# Altium schematic sheet Motor_Driver.SchDoc
size C; DrawnBy: Nurul Hidayat; Engineer: Nurul Hidayat; SheetNumber: 1; SheetTotal: 4
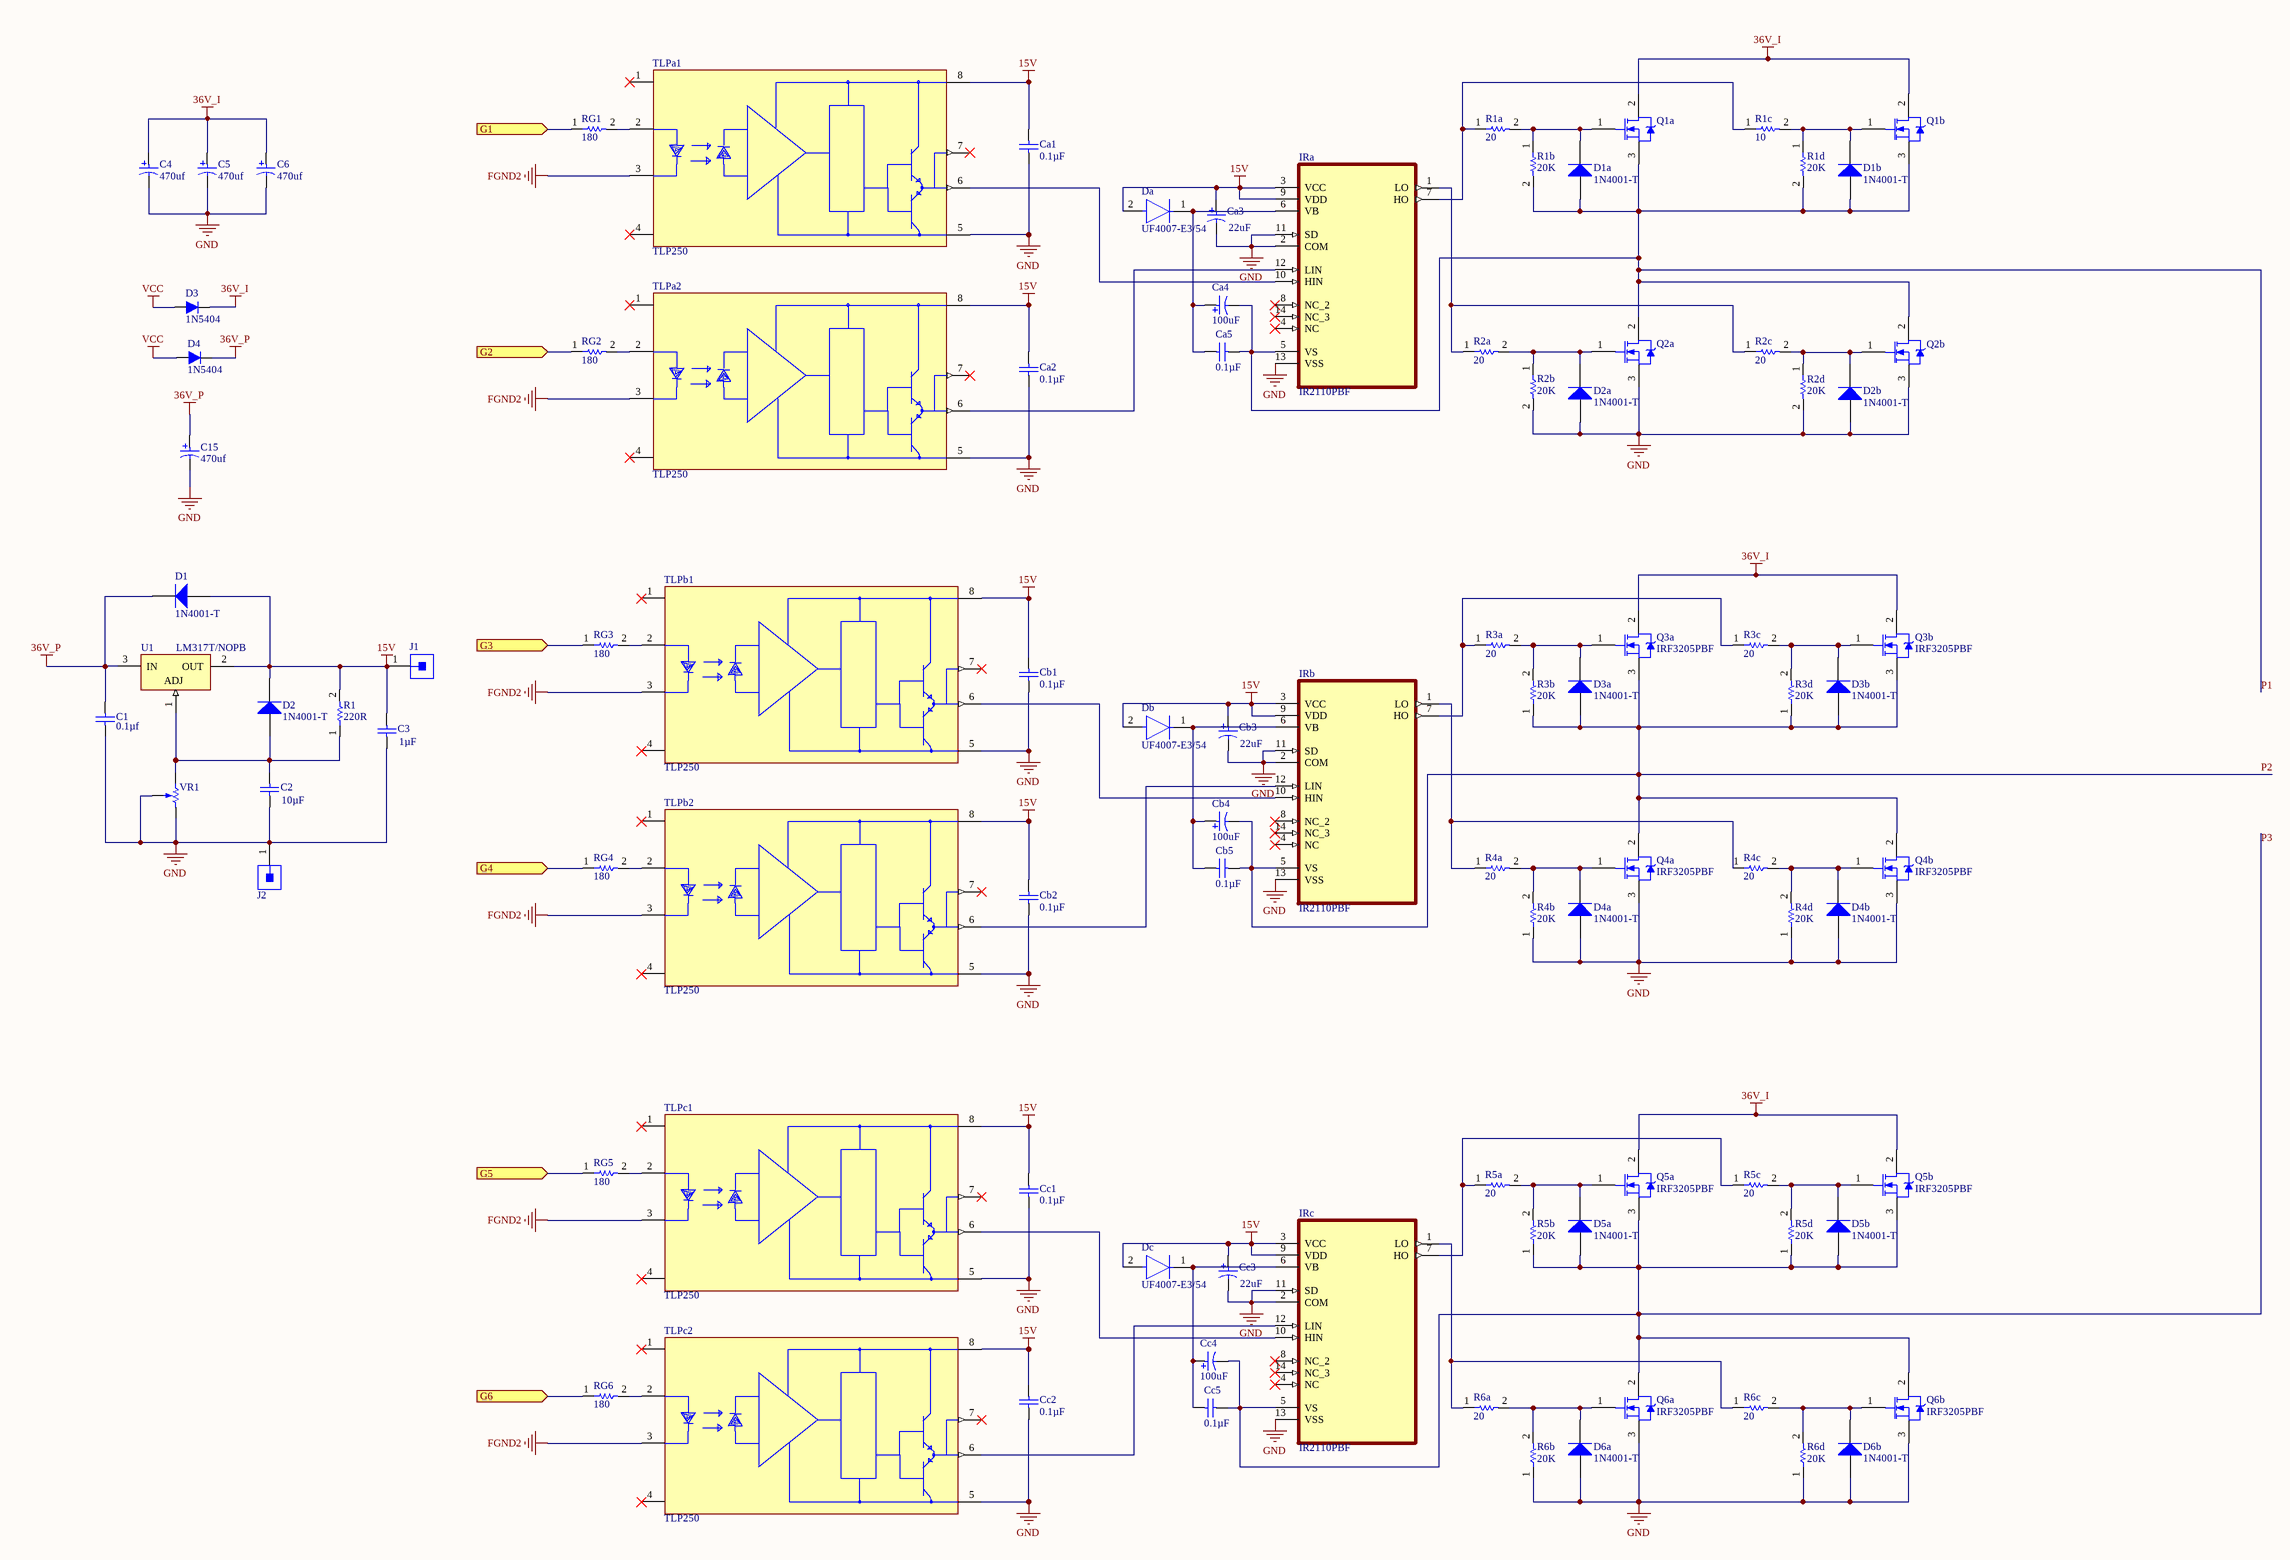
[diagram p0: Motor_Driver.SchDoc]

## Parts
C1  0.1µF  [Cap-0.1uf-50V-Ceramic1]
C2  Capacitance: 10µF  [Cap-0.1uf-50v-ceramic]  (hidden comment: K104K15X7RF5TL2)
C3  Capacitance: 1µF  [Cap-0.1uf-50v-ceramic]  (hidden comment: K104K15X7RF5TL2)
C4  470uf  [Cap-470uf-63v-radial]
C5  470uf  [Cap-470uf-63v-radial]
C6  470uf  [Cap-470uf-63v-radial]
C15  470uf  [Cap-470uf-63v-radial]
Ca1  0.1µF  [Cap-0.1uf-50V-Ceramic1]
Ca2  0.1µF  [Cap-0.1uf-50V-Ceramic1]
Ca3  Capacitance: 22uF  [CAP-22uf-50v-radial]  (hidden comment: ECA1HM220)
Ca4  Capacitance: 100uF  [Cap-100uf-50v-radial]  (hidden comment: ECA1HM101)
Ca5  0.1µF  [Cap-0.1uf-50V-Ceramic1]
Cb1  0.1µF  [Cap-0.1uf-50V-Ceramic1]
Cb2  0.1µF  [Cap-0.1uf-50V-Ceramic1]
Cb3  Capacitance: 22uF  [CAP-22uf-50v-radial]  (hidden comment: ECA1HM220)
Cb4  Capacitance: 100uF  [Cap-100uf-50v-radial]  (hidden comment: ECA1HM101)
Cb5  0.1µF  [Cap-0.1uf-50V-Ceramic1]
Cc1  0.1µF  [Cap-0.1uf-50V-Ceramic1]
Cc2  0.1µF  [Cap-0.1uf-50V-Ceramic1]
Cc3  Capacitance: 22uF  [CAP-22uf-50v-radial]  (hidden comment: ECA1HM220)
Cc4  Capacitance: 100uF  [Cap-100uf-50v-radial]  (hidden comment: ECA1HM101)
Cc5  0.1µF  [Cap-0.1uf-50V-Ceramic1]
D1  1N4001-T  [Diode-1N4001]
D1a  1N4001-T  [Diode-1N4001]
D1b  1N4001-T  [Diode-1N4001]
D2  1N4001-T  [Diode-1N4001]
D2a  1N4001-T  [Diode-1N4001]
D2b  1N4001-T  [Diode-1N4001]
D3  1N5404  [Diode-1N5404]
D3a  1N4001-T  [Diode-1N4001]
D3b  1N4001-T  [Diode-1N4001]
D4  1N5404  [Diode-1N5404]
D4a  1N4001-T  [Diode-1N4001]
D4b  1N4001-T  [Diode-1N4001]
D5a  1N4001-T  [Diode-1N4001]
D5b  1N4001-T  [Diode-1N4001]
D6a  1N4001-T  [Diode-1N4001]
D6b  1N4001-T  [Diode-1N4001]
Da  UF4007-E3/54  [Diode-UF4007]
Db  UF4007-E3/54  [Diode-UF4007]
Dc  UF4007-E3/54  [Diode-UF4007]
IRa  IR2110PBF  [Mosfet-Driver-IR2110PBF]
IRb  IR2110PBF  [Mosfet-Driver-IR2110PBF]
IRc  IR2110PBF  [Mosfet-Driver-IR2110PBF]
J1  61300111121  [PIN-HEADER-1PIN]  (value not drawn)
J2  61300111121  [PIN-HEADER-1PIN]  (value not drawn)
Q1a  IRF3205PBF  [Mosfet-IRF3205]  (value not drawn)
Q1b  IRF3205PBF  [Mosfet-IRF3205]  (value not drawn)
Q2a  IRF3205PBF  [Mosfet-IRF3205]  (value not drawn)
Q2b  IRF3205PBF  [Mosfet-IRF3205]  (value not drawn)
Q3a  IRF3205PBF  [Mosfet-IRF3205]
Q3b  IRF3205PBF  [Mosfet-IRF3205]
Q4a  IRF3205PBF  [Mosfet-IRF3205]
Q4b  IRF3205PBF  [Mosfet-IRF3205]
Q5a  IRF3205PBF  [Mosfet-IRF3205]
Q5b  IRF3205PBF  [Mosfet-IRF3205]
Q6a  IRF3205PBF  [Mosfet-IRF3205]
Q6b  IRF3205PBF  [Mosfet-IRF3205]
R1  220R  [Resistor-1-Watt]
R1a  20  [Resistor-1-Watt]
R1b  20K  [Resistor-1-Watt]
R1c  10  [Resistor-1-Watt]
R1d  20K  [Resistor-1-Watt]
R2a  20  [Resistor-1-Watt]
R2b  20K  [Resistor-1-Watt]
R2c  20  [Resistor-1-Watt]
R2d  20K  [Resistor-1-Watt]
R3a  20  [Resistor-1-Watt]
R3b  20K  [Resistor-1-Watt]
R3c  20  [Resistor-1-Watt]
R3d  20K  [Resistor-1-Watt]
R4a  20  [Resistor-1-Watt]
R4b  20K  [Resistor-1-Watt]
R4c  20  [Resistor-1-Watt]
R4d  20K  [Resistor-1-Watt]
R5a  20  [Resistor-1-Watt]
R5b  20K  [Resistor-1-Watt]
R5c  20  [Resistor-1-Watt]
R5d  20K  [Resistor-1-Watt]
R6a  20  [Resistor-1-Watt]
R6b  20K  [Resistor-1-Watt]
R6c  20  [Resistor-1-Watt]
R6d  20K  [Resistor-1-Watt]
RG1  180  [Resistor-1-Watt]
RG2  180  [Resistor-1-Watt]
RG3  180  [Resistor-1-Watt]
RG4  180  [Resistor-1-Watt]
RG5  180  [Resistor-1-Watt]
RG6  180  [Resistor-1-Watt]
TLPa1  TLP250  [Opto-Coupler-TLP250]
TLPa2  TLP250  [Opto-Coupler-TLP250]
TLPb1  TLP250  [Opto-Coupler-TLP250]
TLPb2  TLP250  [Opto-Coupler-TLP250]
TLPc1  TLP250  [Opto-Coupler-TLP250]
TLPc2  TLP250  [Opto-Coupler-TLP250]
U1  LM317T/NOPB  [Voltage-Regulator-LM317]
VR1  3296W-1-103LF  [Resistor-Trimmer]  (value not drawn)

## Ports
G1 (in), G2 (in), G3 (in), G4 (in), G5 (in), G6 (in)

## Nets
15V: C3.2 Ca1.2 Ca2.2 Ca3.1 Cb1.2 Cb2.2 Cb3.1 Cc1.2 Cc2.2 Cc3.1 D1.1(A) D2.2(K) Da.2(A) Db.2(A) Dc.2(A) IRa.3(VCC) IRa.9(VDD) IRb.3(VCC) IRb.9(VDD) IRc.3(VCC) IRc.9(VDD) J1.1 R1.2 TLPa1.8(VCC) TLPa2.8(VCC) TLPb1.8(VCC) TLPb2.8(VCC) TLPc1.8(VCC) TLPc2.8(VCC) U1.2(OUT)
36V_I: C4.1 C5.1 C6.1 D3.2(K) Q1a.2(D) Q1b.2(D) Q3a.2(D) Q3b.2(D) Q5a.2(D) Q5b.2(D)
36V_P: C1.2 C15.1 D1.2(K) D4.2(K) U1.3(IN)
FGND2: TLPa1.3(C) TLPa2.3(C) TLPb1.3(C) TLPb2.3(C) TLPc1.3(C) TLPc2.3(C)
GND: C1.1 C2.1 C3.1 C4.2 C5.2 C6.2 C15.2 Ca1.1 Ca2.1 Ca3.2 Cb1.1 Cb2.1 Cb3.2 Cc1.1 Cc2.1 Cc3.2 D2a.1(A) D2b.1(A) D4a.1(A) D4b.1(A) D6a.1(A) D6b.1(A) IRa.2(COM) IRa.11(SD) IRa.13(VSS) IRb.2(COM) IRb.11(SD) IRb.13(VSS) IRc.2(COM) IRc.11(SD) IRc.13(VSS) J2.1 Q2a.3(S) Q2b.3(S) Q4a.3(S) Q4b.3(S) Q6a.3(S) Q6b.3(S) R2b.2 R2d.2 R4b.1 R4d.1 R6b.1 R6d.1 TLPa1.5(GND) TLPa2.5(GND) TLPb1.5(GND) TLPb2.5(GND) TLPc1.5(GND) TLPc2.5(GND) VR1.2(S) VR1.3(CW)
VCC: D3.1(A) D4.1(A)
G1: RG1.1 ; port G1
G2: RG2.1 ; port G2
G3: RG3.1 ; port G3
G4: RG4.1 ; port G4
G5: RG5.1 ; port G5
G6: RG6.1 ; port G6
P1: Ca4.2 Ca5.1 D1a.1(A) D1b.1(A) IRa.5(VS) Q1a.3(S) Q1b.3(S) Q2a.2(D) Q2b.2(D) R1b.2 R1d.2
P2: Cb4.2 Cb5.1 D3a.1(A) D3b.1(A) IRb.5(VS) Q3a.3(S) Q3b.3(S) Q4a.2(D) Q4b.2(D) R3b.1 R3d.1
P3: Cc4.2 Cc5.1 D5a.1(A) D5b.1(A) IRc.5(VS) Q5a.3(S) Q5b.3(S) Q6a.2(D) Q6b.2(D) R5b.1 R5d.1
NetC2_2: C2.2 D2.1(A) R1.1 U1.1(ADJ) VR1.1(CCW)
NetCa4_1: Ca4.1 Ca5.2 Da.1(C) IRa.6(VB)
NetCb4_1: Cb4.1 Cb5.2 Db.1(C) IRb.6(VB)
NetCc4_1: Cc4.1 Cc5.2 Dc.1(C) IRc.6(VB)
NetD1a_2: D1a.2(K) Q1a.1(G) R1a.2 R1b.1
NetD1b_2: D1b.2(K) Q1b.1(G) R1c.2 R1d.1
NetD2a_2: D2a.2(K) Q2a.1(G) R2a.2 R2b.1
NetD2b_2: D2b.2(K) Q2b.1(G) R2c.2 R2d.1
NetD3a_2: D3a.2(K) Q3a.1(G) R3a.2 R3b.2
NetD3b_2: D3b.2(K) Q3b.1(G) R3c.2 R3d.2
NetD4a_2: D4a.2(K) Q4a.1(G) R4a.2 R4b.2
NetD4b_2: D4b.2(K) Q4b.1(G) R4c.2 R4d.2
NetD5a_2: D5a.2(K) Q5a.1(G) R5a.2 R5b.2
NetD5b_2: D5b.2(K) Q5b.1(G) R5c.2 R5d.2
NetD6a_2: D6a.2(K) Q6a.1(G) R6a.2 R6b.2
NetD6b_2: D6b.2(K) Q6b.1(G) R6c.2 R6d.2
NetIRa_1: IRa.1(LO) R2a.1 R2c.1
NetIRa_7: IRa.7(HO) R1a.1 R1c.1
NetIRa_10: IRa.10(HIN) TLPa1.6(VO(Output))
NetIRa_12: IRa.12(LIN) TLPa2.6(VO(Output))
NetIRb_1: IRb.1(LO) R4a.1 R4c.1
NetIRb_7: IRb.7(HO) R3a.1 R3c.1
NetIRb_10: IRb.10(HIN) TLPb1.6(VO(Output))
NetIRb_12: IRb.12(LIN) TLPb2.6(VO(Output))
NetIRc_1: IRc.1(LO) R6a.1 R6c.1
NetIRc_7: IRc.7(HO) R5a.1 R5c.1
NetIRc_10: IRc.10(HIN) TLPc1.6(VO(Output))
NetIRc_12: IRc.12(LIN) TLPc2.6(VO(Output))
NetRG1_2: RG1.2 TLPa1.2(A)
NetRG2_2: RG2.2 TLPa2.2(A)
NetRG3_2: RG3.2 TLPb1.2(A)
NetRG4_2: RG4.2 TLPb2.2(A)
NetRG5_2: RG5.2 TLPc1.2(A)
NetRG6_2: RG6.2 TLPc2.2(A)

Not connected (* = marked no-connect by the designer): IRa 4(NC)* 8(NC_2)* 14(NC_3)*; IRb 4(NC)* 8(NC_2)* 14(NC_3)*; IRc 4(NC)* 8(NC_2)* 14(NC_3)*; TLPa1 1(NC)* 4(NC)* 7(VO)*; TLPa2 1(NC)* 4(NC)* 7(VO)*; TLPb1 1(NC)* 4(NC)* 7(VO)*; TLPb2 1(NC)* 4(NC)* 7(VO)*; TLPc1 1(NC)* 4(NC)* 7(VO)*; TLPc2 1(NC)* 4(NC)* 7(VO)*

## Library data of the parts
C1 Ca1 Ca2 Ca5 Cb1 Cb2 Cb5 Cc1 Cc2 Cc5 = Cap-0.1uf-50V-Ceramic_1: Lead Capacitor X7R_EIA_ with Capacitance: 0.10F and Rated Voltage: 50Vdc; MP: RDER71H104K0K1H03B; MF: Murata; Package: NONSTANDARD; Price: None; Availability: Unavailable; SnapEDA_Link: https://www.snapeda.com/parts/RDER71H104K0K1H03B/Murata/view-part/4545566/?ref=snap
  C1: Value: 0.1µf
  Ca1 Ca2 Ca5 Cb1 Cb2 Cb5 Cc1 Cc2 Cc5: Value: *
C2 C3 = Cap-0.1uf-50v-ceramic: Ceramic Capacitor, 100 nF, +/- 10%, 50 V, -55 to 125 degC, 2-Pin THD, RoHS, Tape and Reel; Manufacturer: Vishay; Other Names: BC1084CT; Catalog Drawings: Mono-KapSide2-15_5.58Mono-KapSide1_15; Temperature Coefficient: X7R; Voltage - Rated: 50V; Online Catalog: Mono-Kap™Series; Size / Dimension: 0.157"Lx0.098"W(4.00mmx2.50mm); Operating Temperature: -55°C~125°C; Family: CeramicCapacitors; Manufacturer URL: http://www.vishay.com/; Standard Package: 1; Thickness (Max): -; Ratings: -; Datasheet Version: 08/2013; Package Description: 2-Pin Through Hole Device, Body 4 x 2.6 mm; Mounting Type: ThroughHole; Features: -; Lead Spacing: 0.098"(2.50mm); Tolerance: ±10%; Category: Capacitors; Mounting Technology: ThroughHole; Lead Style: Straight; Datasheet URL: http://www.vishay.com/docs/45171/kseries.pdf; Applications: GeneralPurpose; Package / Case: Radial; Height - Seated (Max): 0.220"(5.58mm); Package Reference: K104K15X7RF5TL2; Series: Mono-Kap™K; Packaging: CutTape(CT)
C4-C6 C15 = Cap-470uf-63v-radial: Aluminum Electrolytic Capacitor, 470 uF, +/- 20%, 50 V, -40 to 85 degC, 2-Pin THD, RoHS, Bulk; Voltage Rating: 10 V; Case\Package: 1210; Tolerance: 10%; Capacitance: 47 uF; Type (Capacitors): X7R; ComponentLink1URL: http://www.panasonic.com/; PackageDescription: 2-Pin Radial Lead, Dia 10 mm, Body Length 20 mm; RoHSCompliant: true; Mount: Surface Mount; Radiation Hardening: No; PackageReference: CAPPR65-500-2000X1000X2200; ComponentLink1Description: Manufacturer URL; DatasheetVersion: Mar-16; Case Code (Imperial): 1210; Max Operating Temperature: 125 degC; Height: 2.5 mm; Voltage Rating (DC): 10 V; REACH SVHC: No SVHC; ComponentLink2URL: http://industrial.panasonic.com/cdbs/www-data/pdf/RDF0000/ABA0000C1047.pdf; Length: 3.2 mm; Min Operating Temperature: -55 degC; Case Code (Metric): 3225; Width: 2.5 mm; Pins: 2; Packaging: Tape and Reel; Package Quantity: 1000; ComponentLink2Description: Datasheet
Ca3 Cb3 Cc3 = Cap-22uf-50v-radial: Aluminum Electrolytic Capacitor, 22 uF, +/- 20%, 50 V, -40 to 85 degC, 2-Pin THD, RoHS, Bulk; Manufacturer: Panasonic; Ripple Current: 100mA; Life (Hours): 2000Hour; Voltage: 50V; Dissipation Factor: 0.12%; Leakage Current: 3uA; Lead/Base Style: Straight; Lead Diameter: 0.5mm; Max Operating Temperature: 85degC; Height: 11mm; Package Reference: CAPPR55-200-1100X500X1200; Radiation Hardening: No; RoHSCompliant: true; Termination: Radial; Case/Package: Radial; REACH SVHC: NoSVHC; Height - Seated (Max): 0.472inch; Min Operating Temperature: -40degC; Packaging: Bulk; Manufacturer URL: http://www.panasonic.com/; Length: 11mm; Tolerance: 20%; Voltage Rating: 50V; Voltage Rating (DC): 50V; Datasheet URL: https://industrial.panasonic.com/cdbs/www-data/pdf/RDF0000/ABA0000C1218.pdf; Lead Pitch: 2mm; Ripple Current (AC): 100mA; Package Description: 2-Pin Radial Lead, Dia 5 mm, Height 12 mm; Diameter: 5mm; Datasheet Version: Rev. 05, 10/2016; Package Quantity: 200; Mount: ThroughHole
Ca4 Cb4 Cc4 = Cap-100uf-50v-radial: Aluminum Electrolytic Capacitor, 100 uF, +/- 20%, 50 V, -40 to 85 degC, 2-Pin THD, RoHS, Bulk; Manufacturer: Panasonic; Lead Diameter: 0.6mm; Dielectric Material: Aluminium; Voltage Rating (DC): 50V; Ripple Current (AC): 250mA; Polarity: Polar; Leakage Current: 3uA; Life (Hours): 2000Hour; Lead/Base Style: Straight; Dissipation Factor: 0.12%; Radiation Hardening: No; Height: 11.5mm; Package Quantity: 200; Package Reference: CAPPR65-350-1150X800X1250; Min Operating Temperature: -40degC; Mount: ThroughHole; Package Description: 2-Pin Radial Lead, Dia 8 mm, Height 12.5 mm; Case/Package: Radial; Diameter: 8mm; Voltage Rating: 50V; Length: 11.5mm; REACH SVHC: NoSVHC; Height - Seated (Max): 0.492inch; Datasheet URL: https://industrial.panasonic.com/cdbs/www-data/pdf/RDF0000/ABA0000C1218.pdf; RoHSCompliant: true; Ripple Current: 250mA; Lead Free: LeadFree; Voltage: 50V; Manufacturer URL: http://www.panasonic.com/; Number of Pins: 2; Datasheet Version: Rev. 05, 10/2016; Packaging: Bulk; Termination: Radial; Max Operating Temperature: 85degC; Tolerance: 20%; Lead Pitch: 3.5mm
D1 D2 = Diode-1N4001: 1.0 A Rectifier, 15 pF, 50 V, -65 to 150 degC, 2-Pin DO-41 Plastic, RoHS, Tape and Reel; Manufacturer: Diodes Inc; Max. Average Rectified Current IO (A): 1; Max. IFSM (A): 30; CT (pF): 15; Max. IR (uA): 5; VRRM (V): 50; DatasheetVersion: Rev. 8-2; ComponentLink2Description: Datasheet; PartNumber: 1N4001-T; ComponentLink2URL: http://diodes.com/datasheets/ds28002.pdf; PackageDescription: 2-Pin Axial Lead, Body 4.635 x 2.36 mm, Lead Spread 25.4 mm; ComponentLink1Description: Manufacturer URL; RoHS: TRUE; Mounting Technology: Through Hole; Packing: Tape and Reel; Operating Temperature Range (degC): -65 to 150; VF (V): 1; ComponentLink1URL: http://diodes.com/; PackageReference: DO-41-P-2
D1a D1b D2a D2b D3a D3b D4a D4b D5a D5b D6a D6b = Diode-1N4001: 1.0 A Rectifier, 15 pF, 50 V, -65 to 150 degC, 2-Pin DO-41 Plastic, RoHS, Tape and Reel; Manufacturer: Diodes Inc; VF (V): 1; CT (pF): 15; Max. IR (uA): 5; VRRM (V): 50; Max. IFSM (A): 30; RoHS: TRUE; Mounting Technology: Through Hole; PartNumber: 1N4001-T; ComponentLink2Description: Datasheet; DatasheetVersion: Rev. 8-2; Operating Temperature Range (degC): -65 to 150; Packing: Tape and Reel; PackageReference: DO-41-P-2; ComponentLink1URL: http://diodes.com/; PackageDescription: 2-Pin Axial Lead, Body 4.635 x 2.36 mm, Lead Spread 25.4 mm; ComponentLink2URL: http://diodes.com/datasheets/ds28002.pdf; Max. Average Rectified Current IO (A): 1; ComponentLink1Description: Manufacturer URL
D3 D4 = Diode-1N5404: Standard Recovery Rectifier, 2-Pin Axial_Lead, Pb-Free, Bulk Box; Manufacturer: On Semiconductor; IFSM Max (A): 200; VRRM Max (V): 400; IO(rec) Max (A): 3; ComponentLink3Description: Package Specification; PackageDescription: 2-Pin, Axial Lead, Diameter 5.05 mm; Type: Standard Recovery; PackageVersion: Rev. G, 06/2000; ComponentLink1Description: Manufacturer URL; ComponentLink2Description: Datasheet; Packing: Bulk Box; PackageReference: AXIAL_LEAD-2-267-05; Mounting Technology: Through Hole; DatasheetVersion: Rev. 10; RoHS: TRUE; ComponentLink3URL: http://www.onsemi.com/pub_link/Collateral/267-05.PDF; PartNumber: 1N5404; ComponentLink2URL: http://www.onsemi.com/pub_link/Collateral/1N5400-D.PDF; ComponentLink1URL: http://www.onsemi.com/
Da Db Dc = Diode-UF4007: DIODE GEN PURP 1KV 1A DO204AL; Manufacturer: Vishay; Max Junction Temp: +150°C; Max Repetitive Reverse Voltage: 1000V; Max Surge Forward Current: 30A; Capacitance: 17pF; Peak Reverse Current: 10uA; Value: 17pF; Package: UF4007; Height: 2.7mm; RoHS: TRUE; Device Class L3: Rectifier Diodes; Temperature Range Low: -55°C; Ipc Land Pattern Name: DIOPA1088W105L520D270; Temperature: -55°C to +150°C; Category: Diode; Device Class L2: Diodes; Device Class L1: Discrete Semiconductors; Digikey Description: DIODE GEN PURP 1KV 1A DO204AL; Octopart: https://octopart.com/uf4007-e3%2F54-vishay-42333894; Mouser Description: Rectifiers Vr/1000V Io/1A; ComponentLink2URL: http://www.vishay.com/docs/88755/uf4001.pdf; Lead Free: Yes; Temperature Range High: +150°C; Automotive: No; Manufacturer Part Number: UF4007-E3/54; ComponentLink2Description: Datasheet; Forward Current: 1A
IRa IRb IRc = IR2110PBF: Floating channel designed for bootstrap operation | Fully operational to +500 V | Fully operational to +600 V verstion available _IR2113 | dV/dt immune | Gate drive supply range from 10 to 20 V | Undervoltage lockout for both channels | 3.3 V logic compatible | Separate logic supply range from 3.3 V to 20 V | Logic and power ground + /- 5 V offset | CMOS Schmitt-triggered inputs with pull-down | Cycle by cycle edge-triggered shutdown logic | Matched propagation delay for both channels | Outputs in phase with inputs; MF: Infineon; MP: IR2110PBF; Price: None; Package: DIP-14 Infineon; Value: *; Availability: Unavailable; SnapEDA_Link: https://www.snapeda.com/parts/IR2110PBF/Infineon%20Technologies/view-part/547122/?ref=snap
J1 J2 = Pin-Header-1Pin: THT Vertical Pin Header WR-PHD, Pitch 2.54 mm, Single Row, 1 pins; Manufacturer: Wurth Elektronik; Gender: Male; Working Voltage: 250VAC; Withstanding Voltage: 500VAC; Pin Number: 1; Contact Resistance: 20mOhm; Rated Current: 3A; Pitch: 2.54mm; Mounting Technology: THT; Datasheet URL: https://katalog.we-online.de/em/datasheet/6130xx11121.pdf; Manufacturer URL: http://www.we-online.de; Operating Temperature: -40to105degC; Publisher: WurthElektronik; Part Number: 61300111121; Row Number: Single; Package Reference: 61300111121; Orientation: Vertical; Packaging: Bag
Q1a Q1b Q2a Q2b Q3a Q3b Q4a Q4b Q5a Q5b Q6a Q6b = Mosfet-IRF3205: HEXFET(R) Power N-Channel MOSFET, 55 V, 110 A, -55 to 117 degC, 3-Pin TO-220AB, RoHS, Rail/Tube; Manufacturer: International Rectifier; Typical Gate Charge @ Vgs: 146nC@10V; Maximum Gate Source Voltage: ±20V; Maximum Continuous Drain Current: 110A; Typical Input Capacitance @ Vds: 3247pF@25V; Channel Type: N; Minimum Gate Threshold Voltage: 2V; Number of Elements per Chip: 1; Transistor Configuration: Single; Transistor Material: Si; Maximum Drain Source Voltage: 55V; Maximum Gate Threshold Voltage: 4V; Typical Turn-Off Delay Time: 50ns; Typical Turn-On Delay Time: 14ns; Channel Mode: Enhancement; Maximum Drain Source Resistance: 0.008Ω; Maximum Power Dissipation: 200W; Package Version: Feb-04; Package Type: TO-220AB; Width: 4.69mm; Dimensions: 10.54x4.69x8.77mm; Category: PowerMOSFET; Package URL: http://www.infineon.com/dgdl/bts110.pdf?folderId=db3a304412b407950112b43583c16310&fileId=db3a304412b407950112b43584326311&sId=db3a30443e3c704d013e4eb6657a2604; Package Description: 3-Pin Plastic (Green) Transistor Single Outline Package, 9.9 x 9.2 mm Body, 2.54 mm Pitch; Package Reference: PG-TO-220AB; Length: 10.54mm; Height: 8.77mm; Datasheet Version: Jul-10; Minimum Operating Temperature: -55degC; Manufacturer URL: http://internationalrectifier.com/; Datasheet URL: http://datasheet.octopart.com/IRF3205PBF-International-Rectifier-datasheet-10898897.pdf; Maximum Operating Temperature: +175degC; Pin Count: 3; Mounting Type: ThroughHole
R1 R1a R1b R1c R1d R2a R2b R2c R2d R3a R3b R3c R3d R4a R4b R4c R4d R5a R5b R5c R5d R6a R6b R6c R6d RG1-RG6 = Resistor-1-Watt: Resistor; Manufacturer_Name: Ohmite; Manufacturer_Part_Number: OK1025E-R52; Datasheet Link: https://www.alliedelec.com/m/d/7f961050c862e52d900c42b673f6b00a.pdf; Mouser Part Number: 588-OK1025E-R52; Mouser Price/Stock: https://www.mouser.co.uk/ProductDetail/Ohmite/OK1025E-R52?qs=AkUtuiJmyfnfEYTpIxxGIg%3D%3D
TLPa1 TLPa2 TLPb1 TLPb2 TLPc1 TLPc2 = TLP250: Optocoupler Drive Push-Pull 1-CH 30V 600V 8-Pin PDIP; Manufacturer: TOSHIBA; Standoff Height: 0.55mm; Turn Off Delay Time: 0.15us; Max Junction Temp: +125°C; Power Dissipation: 800mW; Forward Current: 10mA; Reverse Voltage: 5V; Forward Voltage: 1.6V; Isolation Voltage: 2500Vrms; Min Supply Voltage: 10V; ComponentLink2Description: Datasheet; Octopart: https://octopart.com/tlp-250-toshiba-99104964; Automotive: No; Temperature Range High: +85°C; Lead Free: Yes; Package: 11-10C4; Category: Trans; Temperature Range Low: -20°C; Ipc Land Pattern Name: DIP762W50P254L966H445Q8; ComponentLink2URL: https://toshiba.semicon-storage.com/info/docget.jsp?did=16821&prodName=TLP250; Device Class L3: unset; Turn On Delay Time: 0.15us; Device Class L2: Optocouplers; Manufacturer Part Number: TLP250; Max Supply Voltage: 30V; Height: 4.85mm; Device Class L1: Optoelectronics; Temperature: -20°C to +85°C; RoHS: TRUE
U1 = Voltage-Regulator-LM317: 3-Terminal Adjustable Regulator, 3-pin TO-220, Pb-Free; Manufacturer: Texas Instruments; PackageTopMarking: NSUZXYTTE#*LM317T P+; PowerWise: N; CompType: LDO IC; ComponentLink1URL: http://www.ti.com/general/docs/lit/getliterature.tsp?genericPartNumber=LM317-N&fileType=pdf; PackageDescription: TO-220, Molded, 3 Lead, Straight; PackageReference: NDE0003A; ComponentLink1Description: Datasheet URL; RoHS: Y; PinCount: 3
VR1 = Resistor-Trimmer: Square Trimpot(R) Trimming Potentiometer, 10 KOhm, +/- 10%, 0.5 W, -55 to 125 degC, 3-Pin THD, RoHS, Tube; Voltage Rating: 75 V; Resistance: 120 Ohm; Tolerance: 1%; Power Rating: 100 mW; Case\Package: 0603; Type (Resistor): Thick Film; PackageDescription: 3-Pin Through Hole Device, Body 9.53 x 4.83 mm, Pitch 2.54 mm; RoHSCompliant: true; Package Quantity: 5000; Case Code (Metric): 1608; PackageReference: 3296W; ComponentLink2Description: Datasheet; REACH SVHC: Unknown; Case Code (Imperial): 0603; ComponentLink1URL: http://www.bourns.com/; Width: 0.85 mm; Radiation Hardening: No; Min Operating Temperature: -55 degC; Mount: Surface Mount; ComponentLink1Description: Manufacturer URL; Max Operating Temperature: 155 degC; Weight: 7.1E-05 oz; Pins: 2; DatasheetVersion: May-16; Packaging: Tape and Reel; Height: 0.45 mm; Length: 1.55 mm; ComponentLink2URL: http://www.bourns.com/docs/Product-Datasheets/3296.pdf